# Altium schematic sheet TASBot64.SchDoc
size A
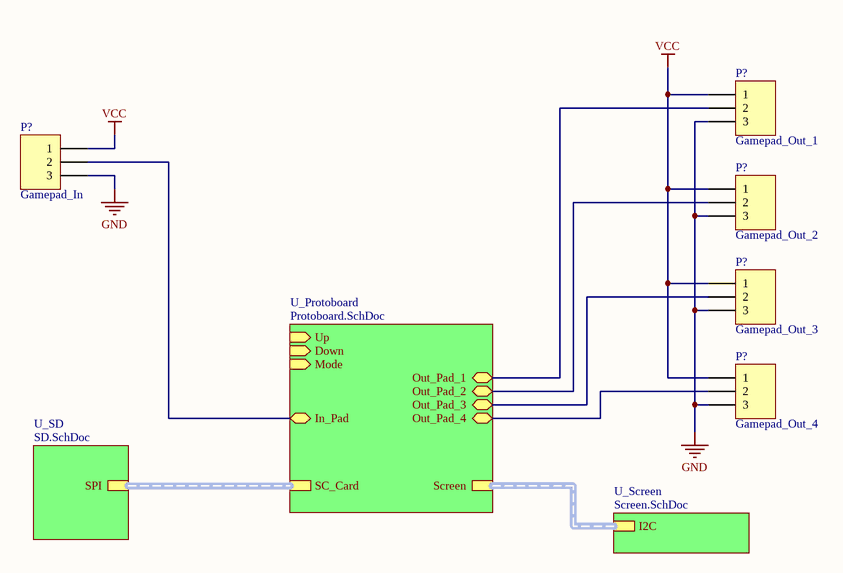
[diagram p0: TASBot64.SchDoc]

## Parts
(Parts that share a designator on the sheet are numbered #1, #2 ... from top to bottom, then left to right.)
P?#1  Gamepad_Out_1  [HDR1X3]
P?#2  Gamepad_In  [HDR1X3]
P?#3  Gamepad_Out_2  [HDR1X3]
P?#4  Gamepad_Out_3  [HDR1X3]
P?#5  Gamepad_Out_4  [HDR1X3]

## Sub-sheets
U_Protoboard = Protoboard.SchDoc: Screen (harness I2C), SC_Card (harness SPI), Up (in), Down (in), Mode (in), In_Pad (bidir), Out_Pad_1 (bidir), Out_Pad_2 (bidir), Out_Pad_3 (bidir), Out_Pad_4 (bidir)
U_Screen = Screen.SchDoc: I2C (harness I2C)
U_SD = SD.SchDoc: SPI (harness SPI)

## Nets
GND: P?#1.3 P?#2.3 P?#3.3 P?#4.3 P?#5.3
VCC: P?#1.1 P?#2.1 P?#3.1 P?#4.1 P?#5.1
NetP?#1_2: P?#1.2 ; sheet U_Protoboard/Out_Pad_1
NetP?#2_2: P?#2.2 ; sheet U_Protoboard/In_Pad
NetP?#3_2: P?#3.2 ; sheet U_Protoboard/Out_Pad_2
NetP?#4_2: P?#4.2 ; sheet U_Protoboard/Out_Pad_3
NetP?#5_2: P?#5.2 ; sheet U_Protoboard/Out_Pad_4

## Buses and harness runs
harness sheet U_Protoboard/SC_Card = sheet U_SD/SPI
harness sheet U_Protoboard/Screen = sheet U_Screen/I2C

## Library data of the parts
P?#1-P?#5 = Header 3: Header, 3-Pin; LatestRevisionDate: 17-Jul-2002; LatestRevisionNote: Re-released for DXP Platform.; Publisher: Altium Limited